# Altium schematic sheet 01_Power_Input.SchDoc
size A4; SheetNumber: 1; SheetTotal: 6
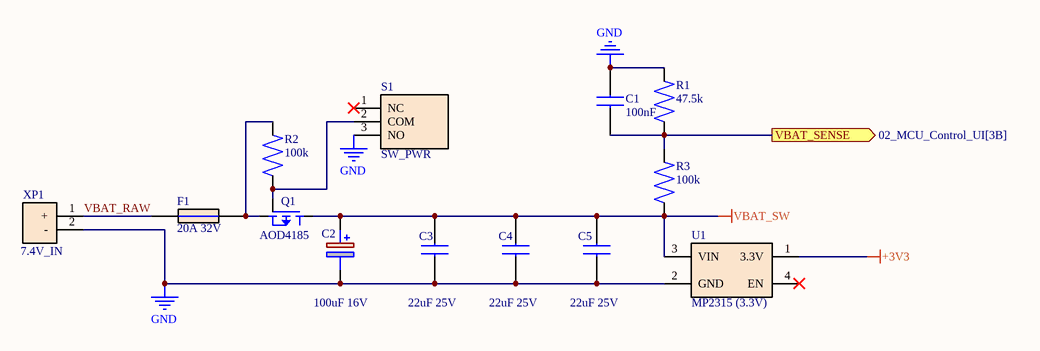
[diagram p0: 01_Power_Input.SchDoc]

## Parts
C1  100nF  [CHIP_0603_SMD]
C2  100uF 16V  [CAP_ALU_SMD_D5.0_L5.4]
C3  22uF 25V  [CHIP_1210_3225]
C4  22uF 25V  [CHIP_1210_3225]
C5  22uF 25V  [CHIP_1210_3225]
F1  20A 32V  [FUSE_HOLDER_MINI_KEYSTONE_3544]
Q1  AOD4185  [TO-252-2L_DPAK_THERMAL]
R1  47.5k  [CHIP_0603_SMD]
R2  100k  [CHIP_0603_SMD]
R3  100k  [CHIP_0603_SMD]
S1  SW_PWR  [TNT_SW_SLIDE_2.5mm]
U1  MP2315 (3.3V)  [MODULE_DC-DC_MP2315_MINI_BUCK_THT]
XP1  7.4V_IN  [CONN_XT30PW-M_2P]

## Ports
VBAT_SENSE (out, see 02_MCU_Control_UI[3B])

## Nets
+3V3: U1.1(3.3V)
GND: C1.2 C2.2(-) C3.1 C4.1 C5.1 R1.2 S1.3(NO) U1.2(GND) XP1.2(-)
VBAT_SW: C2.1(+) C3.2 C4.2 C5.2 Q1.2(D) R3.1 U1.3(VIN)
VBAT_RAW: F1.1 XP1.1(+)
VBAT_SENSE: C1.1 R1.1 R3.2 ; port VBAT_SENSE
NetF1_2: F1.2 Q1.3(S) R2.2
NetQ1_1: Q1.1(G) R2.1 S1.2(COM)

Not connected (* = marked no-connect by the designer): S1 1(NC)*; U1 4(EN)*

## Library data of the parts
C1 = CAP_0603_100nF_50V_X7R: Capacitor MLCC, Ceramic, 100 nF, 50 V, ±10%, X7R, SMD 0603, Samsung Electro-Mechanics; Part Number:: CL10B104KB8NNNC
C2 = CAP_POLY_SMD_100uF_16V_D6.3: Capacitor Polymer Aluminum, 100 uF, 16 V, ±20%, Low ESR, SMD Can 6.3x5.8 mm, Panasonic OS-CON / Nichicon
C3-C5 = CAP_1210_22uF_25V_X7R: Capacitor MLCC, Ceramic, 22 uF, 25 V, ±10%, X7R, SMD 1210, Murata Electronics
F1 = FUSE_MINI_BLADE_20A: Automotive Fuse Mini Blade, 20A, 32V DC, Fast-Acting, with PCB Holder/Clips
Q1 = MOSFET_P-CH_AOD4185: MOSFET P-Channel, -40V, -40A, 20 mOhm @ -10V, TO-252-2L (DPAK), Alpha & Omega Semiconductor
R1 = RES_0603_47.5k_1%: Resistor, 47.5 kOhm, ±1%, 0.1W (1/10W), SMD 0603, Thick Film, Yageo
R2 R3 = RES_0603_100k_1%: Resistor, 100 kOhm, ±1%, 0.1W (1/10W), SMD 0603, Thick Film, Yageo
S1 = SW_SLIDE_SPDT_SS12D00: Slide Switch, SPDT (1P2T), 50V DC 0.5A, Through-Hole (THT), Vertical, Actuator Height 6mm
U1 = MODULE_DC-DC_MP2315_3V3: DC-DC Step-Down Buck Converter Module, MP2315, Vin 4.5V-24V, Vout 3.3V 3A, Sub-Board PCB Mount
XP1 = CONN_XT30PW-M_2P: Connector DC Power, XT30 Male 90° (Right Angle) PCB Mount, 2-Pin, 30A Cont. / 50A Peak, Amass XT30PW-M